# EAGLE board fmcboard_v1.4 (EAGLE 9.6.2)
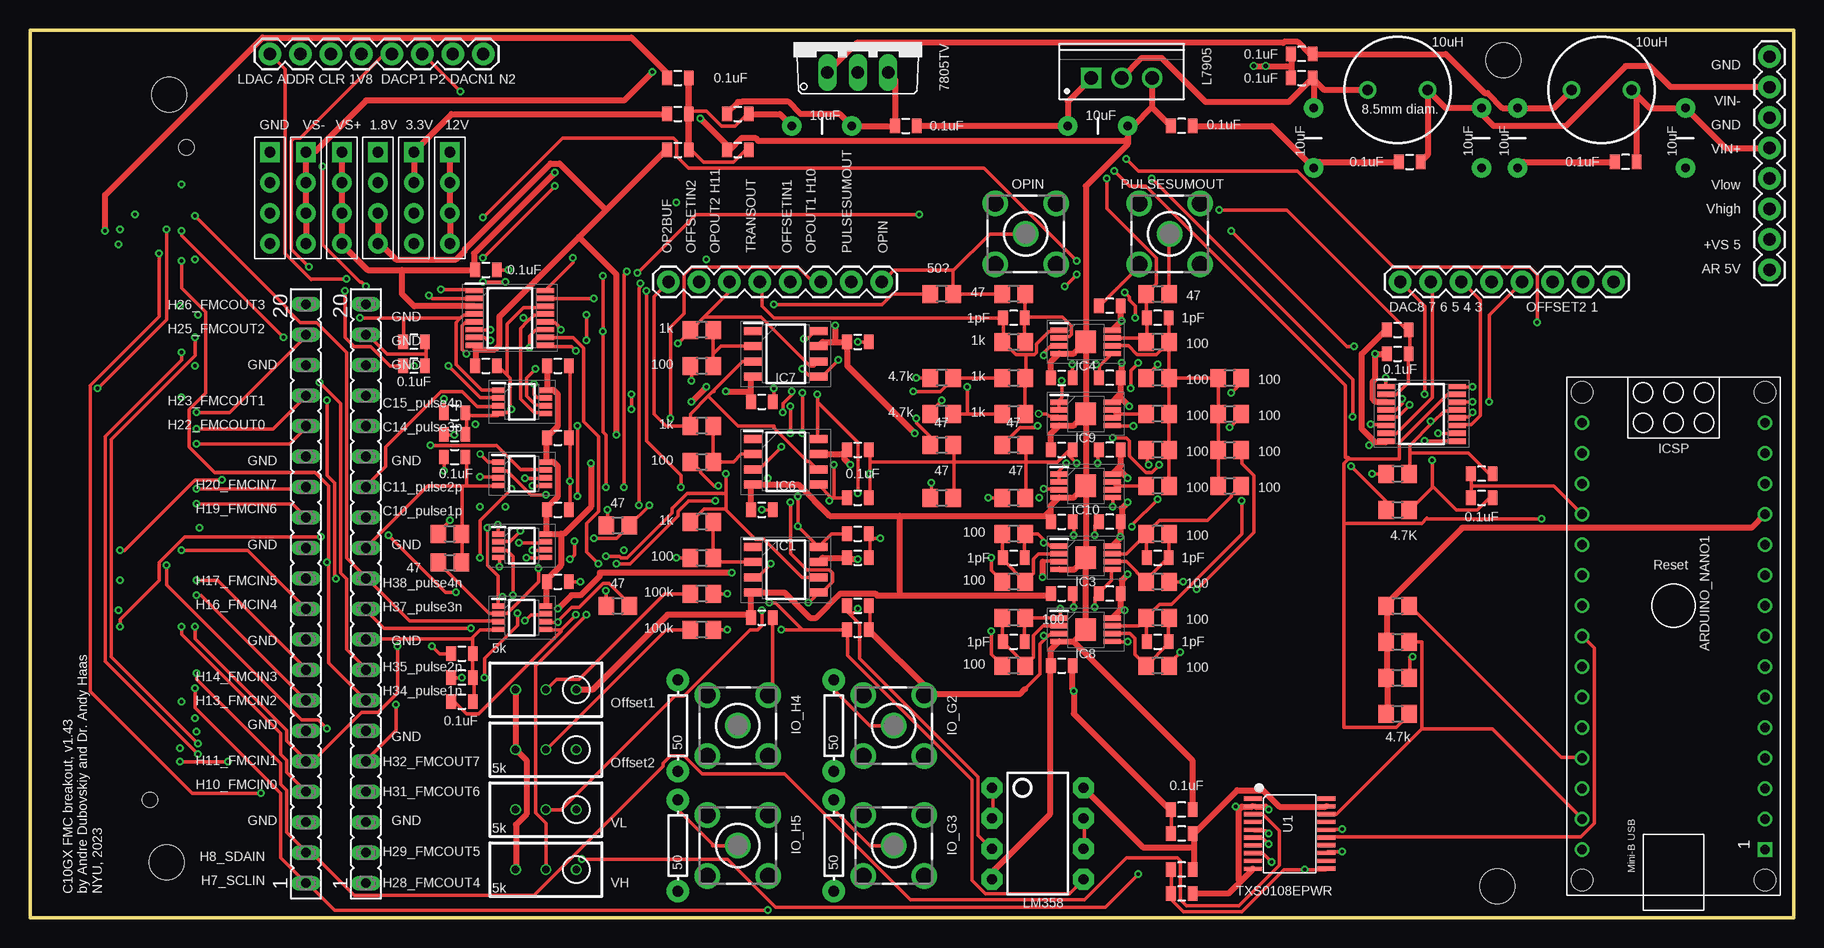
[diagram p4: board, top side]
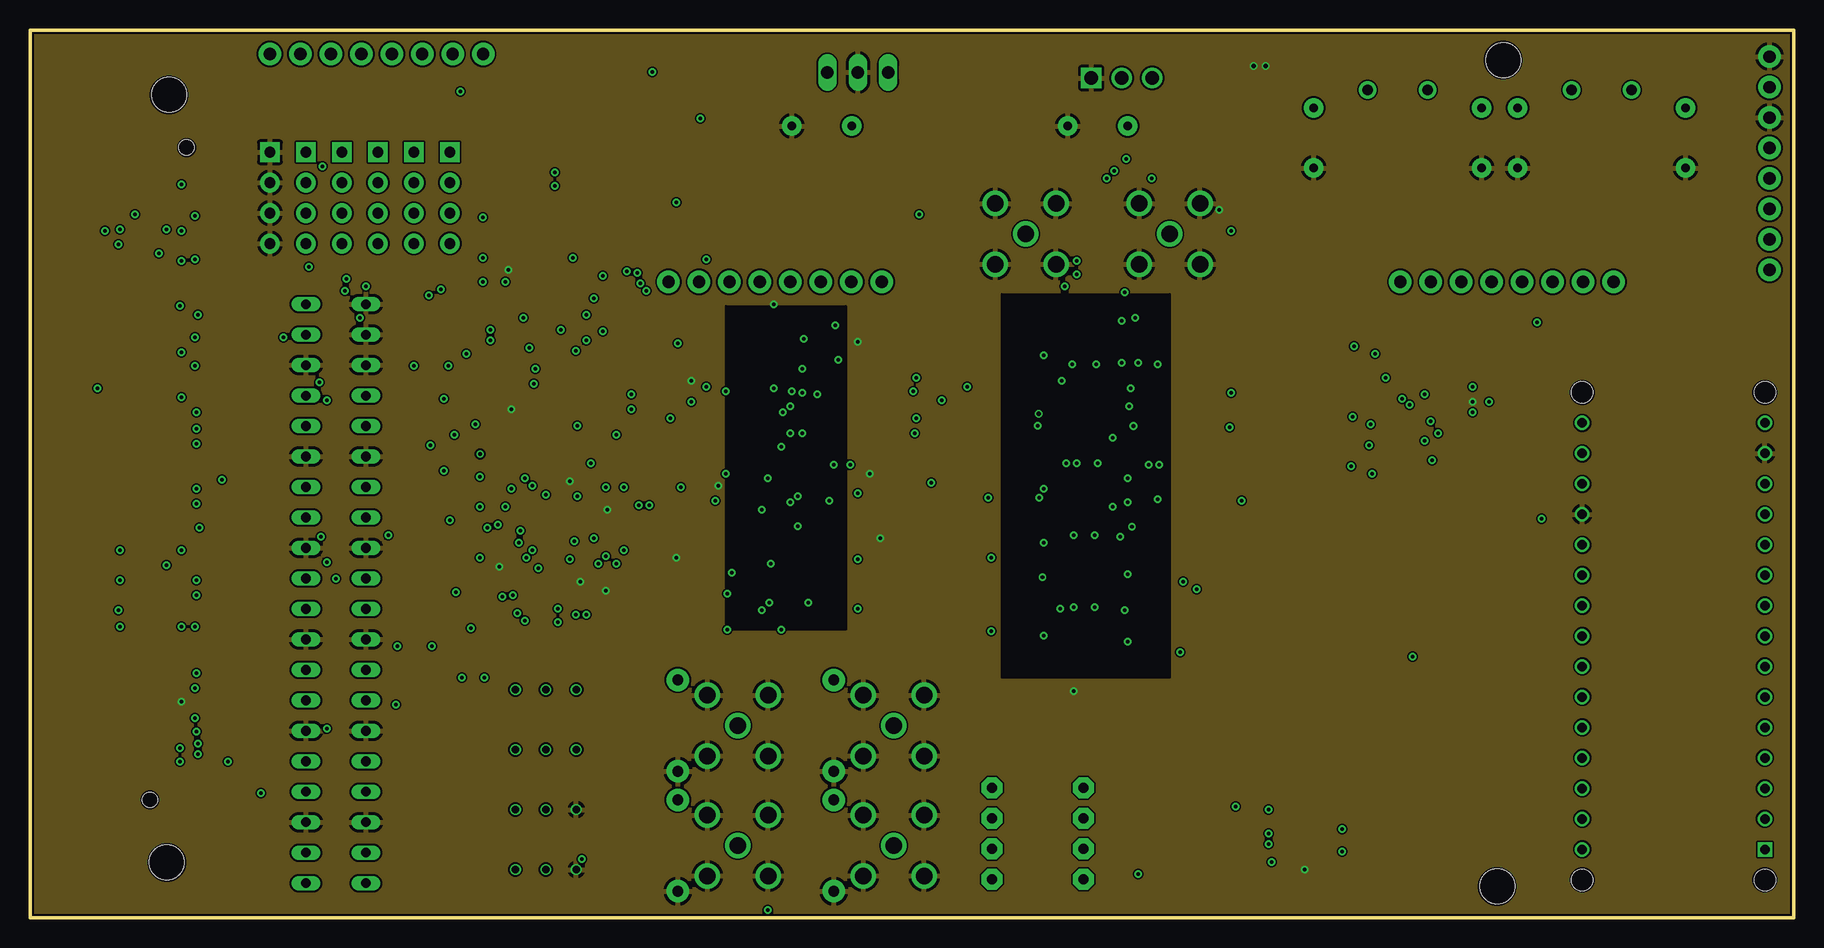
[diagram p5: board, inner layer topgnd]
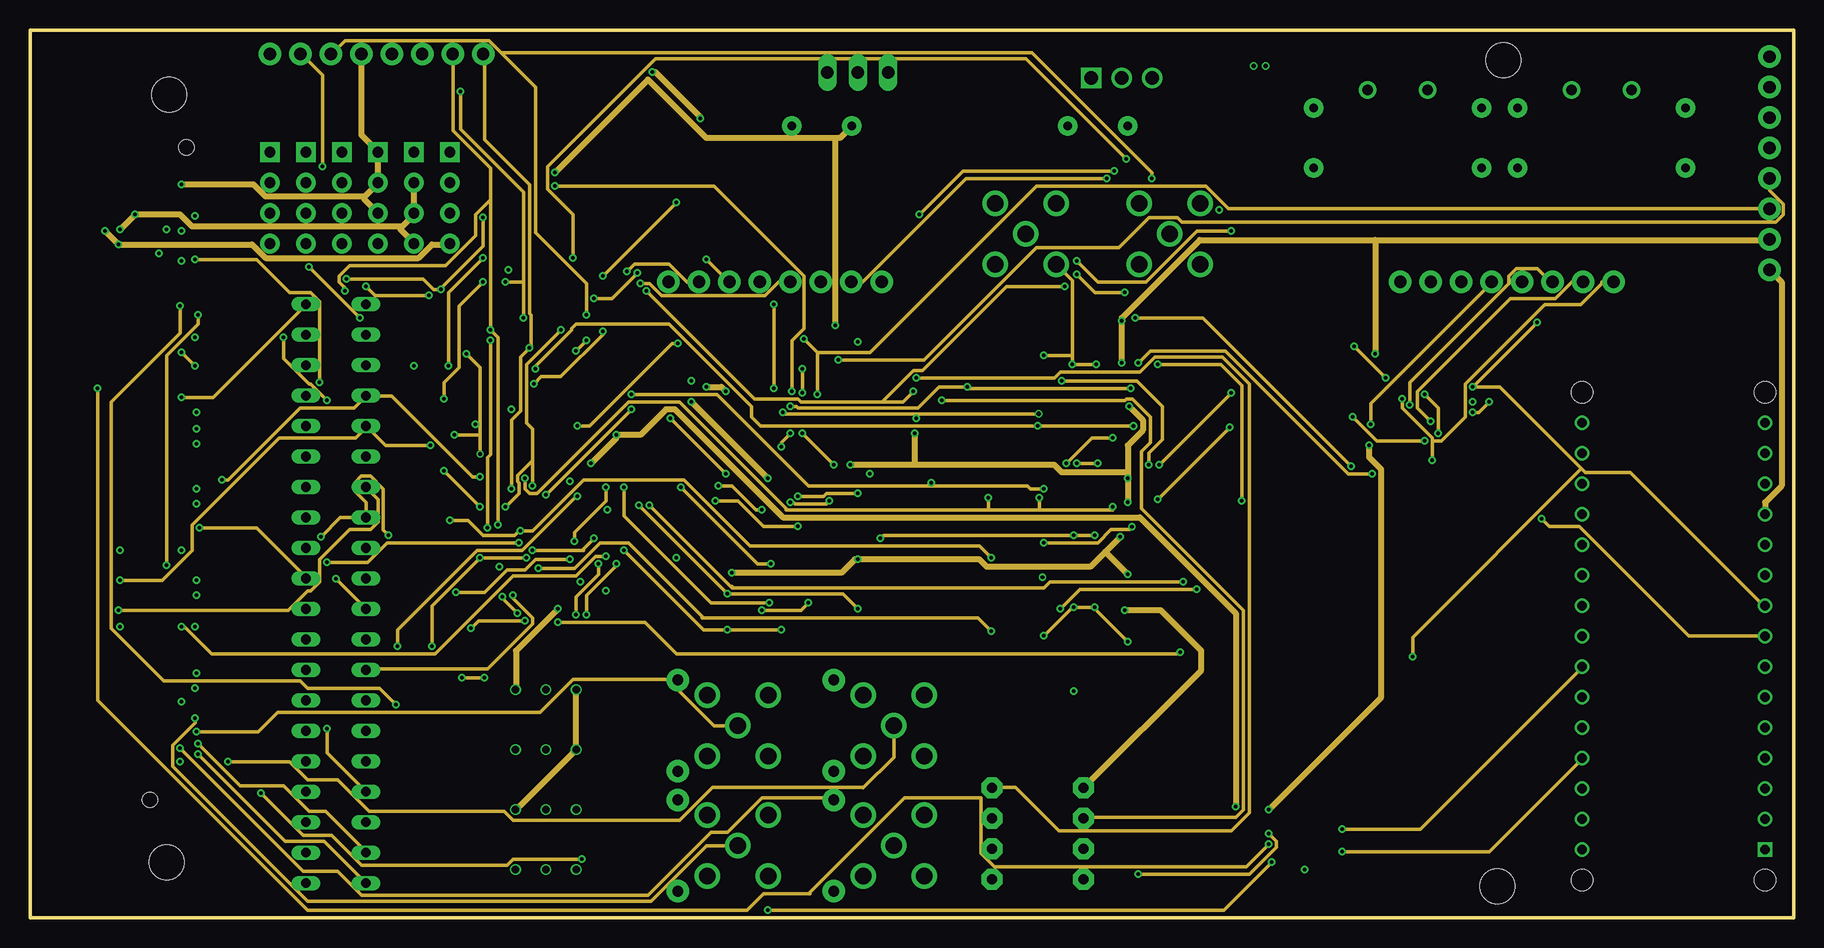
[diagram p6: board, inner layer route]
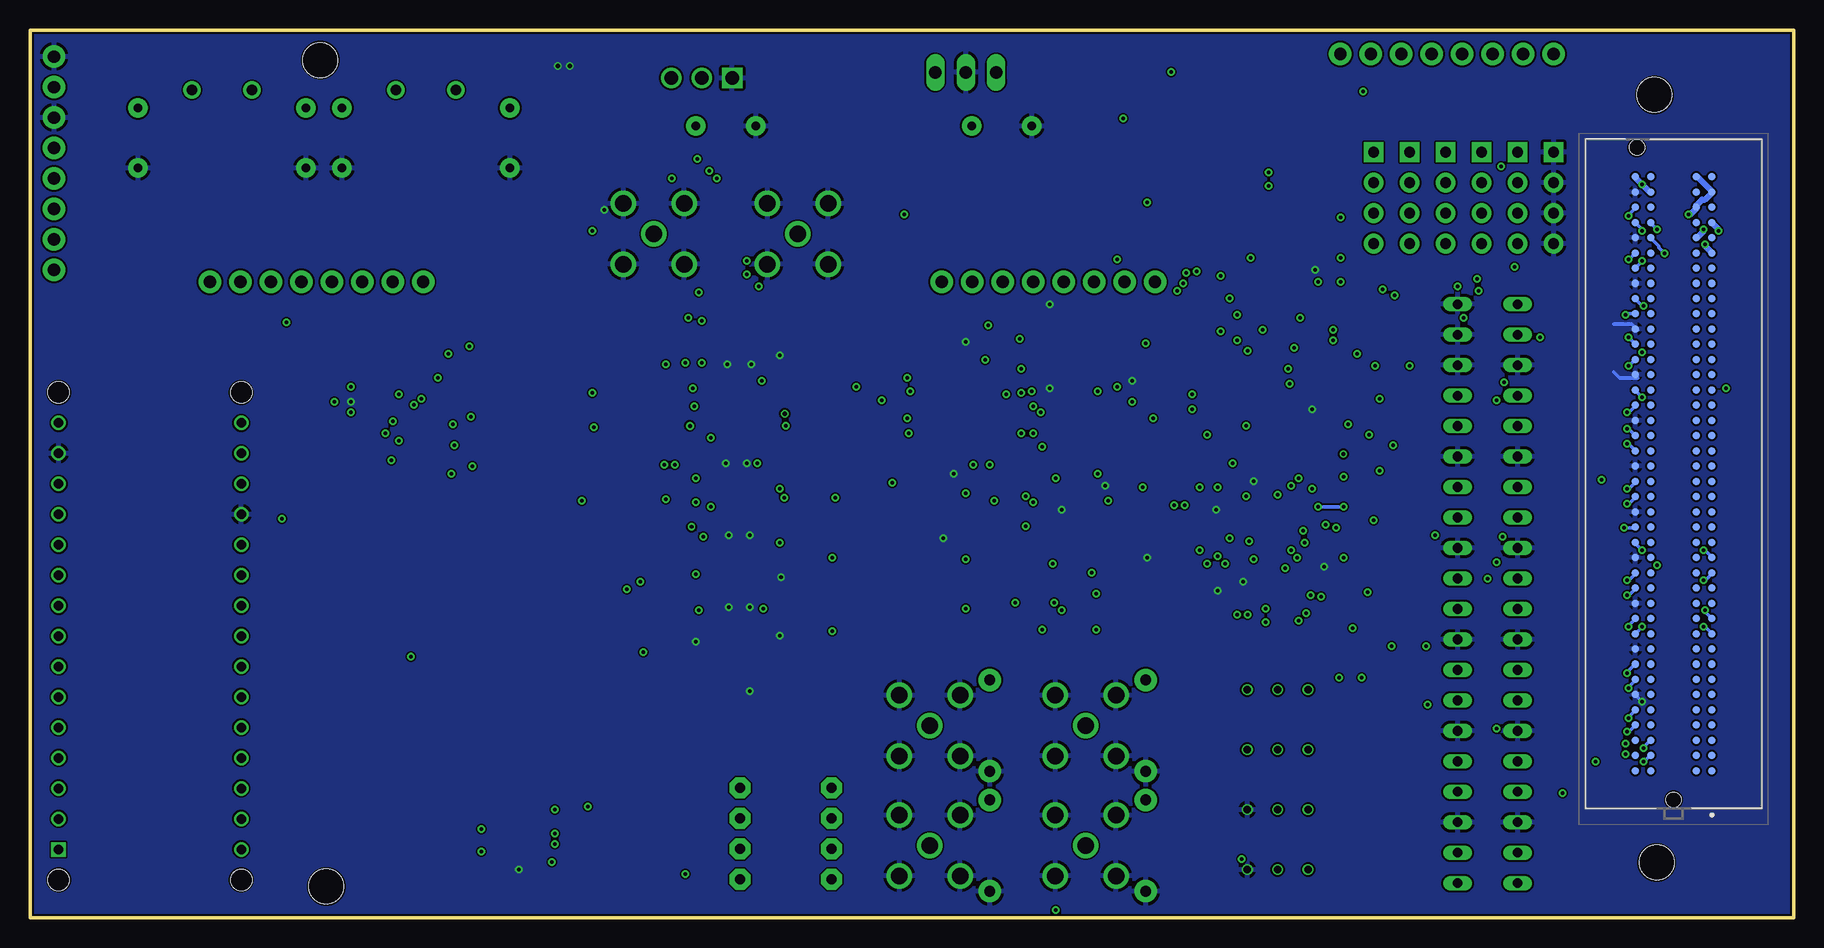
[diagram p7: board, bottom side, seen from below]

Size 147 x 74 mm. Coordinates in mm from the lower left corner, seen from the top.
Outline: 0,74 0,0 147,0 147,74 0,74
Copper layers (1*2*15*16): top 0.035mm / dielectric 0.2mm / topgnd 0.0175mm / dielectric 0.3mm / route 0.0175mm / dielectric 0.2mm / gnd 0.035mm
Design rules "Seeed_AllPCB_MacroFab_haas6mil": minimum track width 6mil, minimum drill 12mil, track to track 6mil, track to pad 6mil, pad to pad 6mil, via to via 6mil, smd to smd 0mil, copper to edge 6mil, drill to drill 6mil, minimum pad ring 6mil, minimum via ring 6mil, stop-mask expansion 6mil, vias tented up to drill 25mil, thermal gap 10mil
Net classes: 0 default: width 0.305 mm; 1 power: width 0.508 mm; 2 gnd: width 0.305 mm
Holes 2.9 mm at 11.4,4.6 122.8,71.5 11.6,68.6 122.3,2.6

## Footprints (pad centres in the part's own frame; a part is rotated, then mirrored left to right if it is on the bottom)
ARDUINO_NANO = drill 0.8 square: 1 -20.32,-7.62 | drill 0.8: 2 -17.78,-7.62; 3 -15.24,-7.62; 4 -12.7,-7.62; 5 -10.16,-7.62; 6 -7.62,-7.62; 7 -5.08,-7.62; 8 -2.54,-7.62; 9 0,-7.62; 10 2.54,-7.62; 11 5.08,-7.62; 12 7.62,-7.62; 13 10.16,-7.62; 14 12.7,-7.62; 15 15.24,-7.62; 16 15.24,7.62; 17 12.7,7.62; 18 10.16,7.62; 19 7.62,7.62; 20 5.08,7.62; 21 2.54,7.62; 22 0,7.62; 23 -2.54,7.62; 24 -5.08,7.62; 25 -7.62,7.62; 26 -10.16,7.62; 27 -12.7,7.62; 28 -15.24,7.62; 29 -17.78,7.62; 30 -20.32,7.62 | hole 1.778: -22.86,-7.62; -22.86,7.62; 17.78,7.62; 17.78,-7.62
CAP-PTH-5MM = drill 0.7 pad 1.651: 1 -2.5,0; 2 2.5,0
0805 = smd 0.8 x 1.2: 1 -0.9,0; 2 0.9,0
SOIC127P600X175-8N = smd 1.528 x 0.65: 1 -2.711,1.905; 2 -2.711,0.635; 3 -2.711,-0.635; 4 -2.711,-1.905; 5 2.711,-1.905; 6 2.711,-0.635; 7 2.711,0.635; 8 2.711,1.905
SOP65P640X120-16N = smd 1.475 x 0.45: 1 -2.938,2.275; 2 -2.938,1.625; 3 -2.938,0.975; 4 -2.938,0.325; 5 -2.938,-0.325; 6 -2.938,-0.975; 7 -2.938,-1.625; 8 -2.938,-2.275; 9 2.938,-2.275; 10 2.938,-1.625; 11 2.938,-0.975; 12 2.938,-0.325; 13 2.938,0.325; 14 2.938,0.975; 15 2.938,1.625; 16 2.938,2.275
SOP65P490X110-9N = smd 1.425 x 0.45: 1 -2.212,0.975; 2 -2.212,0.325; 3 -2.212,-0.325; 4 -2.212,-0.975; 5 2.212,-0.975; 6 2.212,-0.325; 7 2.212,0.325; 8 2.212,0.975 | smd 1.68 x 1.88: 9 0,0
DIP08 = drill 0.813 pad 1.727 octagon: 1 -3.81,-3.81; 2 -1.27,-3.81; 3 1.27,-3.81; 4 3.81,-3.81; 5 3.81,3.81; 6 1.27,3.81; 7 -1.27,3.81; 8 -3.81,3.81
TO220V = drill 1.016 long: 1 -2.54,-2.54; 2 0,-2.54; 3 2.54,-2.54
SOP65P400X130-8N = smd 1.1 x 0.45: 1 -1.95,0.975; 2 -1.95,0.325; 3 -1.95,-0.325; 4 -1.95,-0.975; 5 1.95,-0.975; 6 1.95,-0.325; 7 1.95,0.325; 8 1.95,0.975
BU-SMB-V = drill 1.4: 1 0,0; 2 -2.54,2.54; 3 2.54,2.54; 4 2.54,-2.54; 5 -2.54,-2.54
1X08 = drill 1.016 pad 1.88: 1 0,0; 2 2.54,0; 3 5.08,0; 4 7.62,0; 5 10.16,0; 6 12.7,0; 7 15.24,0; 8 17.78,0
ASP13460401 = smd 0.64 x 0.64: C1 24.765,3.175; C2 23.495,3.175; C3 22.225,3.175; C4 20.955,3.175; C5 19.685,3.175; C6 18.415,3.175; C7 17.145,3.175; C8 15.875,3.175; C9 14.605,3.175; C10 13.335,3.175; C11 12.065,3.175; C12 10.795,3.175; C13 9.525,3.175; C14 8.255,3.175; C15 6.985,3.175; C16 5.715,3.175; C17 4.445,3.175; C18 3.175,3.175; C19 1.905,3.175; C20 0.635,3.175; C21 -0.635,3.175; C22 -1.905,3.175; C23 -3.175,3.175; C24 -4.445,3.175; C25 -5.715,3.175; C26 -6.985,3.175; C27 -8.255,3.175; C28 -9.525,3.175; C29 -10.795,3.175; C30 -12.065,3.175; C31 -13.335,3.175; C32 -14.605,3.175; C33 -15.875,3.175; C34 -17.145,3.175; C35 -18.415,3.175; C36 -19.685,3.175; C37 -20.955,3.175; C38 -22.225,3.175; C39 -23.495,3.175; C40 -24.765,3.175; D1 24.765,1.905; D2 23.495,1.905; D3 22.225,1.905; D4 20.955,1.905; D5 19.685,1.905; D6 18.415,1.905; D7 17.145,1.905; D8 15.875,1.905; D9 14.605,1.905; D10 13.335,1.905; D11 12.065,1.905; D12 10.795,1.905; D13 9.525,1.905; D14 8.255,1.905; D15 6.985,1.905; D16 5.715,1.905; D17 4.445,1.905; D18 3.175,1.905; D19 1.905,1.905; D20 0.635,1.905; D21 -0.635,1.905; D22 -1.905,1.905; D23 -3.175,1.905; D24 -4.445,1.905; D25 -5.715,1.905; D26 -6.985,1.905; D27 -8.255,1.905; D28 -9.525,1.905; D29 -10.795,1.905; D30 -12.065,1.905; D31 -13.335,1.905; D32 -14.605,1.905; D33 -15.875,1.905; D34 -17.145,1.905; D35 -18.415,1.905; D36 -19.685,1.905; D37 -20.955,1.905; D38 -22.225,1.905; D39 -23.495,1.905; D40 -24.765,1.905; G1 24.765,-1.905; G2 23.495,-1.905; G3 22.225,-1.905; G4 20.955,-1.905; G5 19.685,-1.905; G6 18.415,-1.905; G7 17.145,-1.905; G8 15.875,-1.905; G9 14.605,-1.905; G10 13.335,-1.905; G11 12.065,-1.905; G12 10.795,-1.905; G13 9.525,-1.905; G14 8.255,-1.905; G15 6.985,-1.905; G16 5.715,-1.905; G17 4.445,-1.905; G18 3.175,-1.905; G19 1.905,-1.905; G20 0.635,-1.905; G21 -0.635,-1.905; G22 -1.905,-1.905; G23 -3.175,-1.905; G24 -4.445,-1.905; G25 -5.715,-1.905; G26 -6.985,-1.905; G27 -8.255,-1.905; G28 -9.525,-1.905; G29 -10.795,-1.905; G30 -12.065,-1.905; G31 -13.335,-1.905; G32 -14.605,-1.905; G33 -15.875,-1.905; G34 -17.145,-1.905; G35 -18.415,-1.905; G36 -19.685,-1.905; G37 -20.955,-1.905; G38 -22.225,-1.905; G39 -23.495,-1.905; G40 -24.765,-1.905; H1 24.765,-3.175; H2 23.495,-3.175; H3 22.225,-3.175; H4 20.955,-3.175; H5 19.685,-3.175; H6 18.415,-3.175; H7 17.145,-3.175; H8 15.875,-3.175; H9 14.605,-3.175; H10 13.335,-3.175; H11 12.065,-3.175; H12 10.795,-3.175; H13 9.525,-3.175; H14 8.255,-3.175; H15 6.985,-3.175; H16 5.715,-3.175; H17 4.445,-3.175; H18 3.175,-3.175; H19 1.905,-3.175; H20 0.635,-3.175; H21 -0.635,-3.175; H22 -1.905,-3.175; H23 -3.175,-3.175; H24 -4.445,-3.175; H25 -5.715,-3.175; H26 -6.985,-3.175; H27 -8.255,-3.175; H28 -9.525,-3.175; H29 -10.795,-3.175; H30 -12.065,-3.175; H31 -13.335,-3.175; H32 -14.605,-3.175; H33 -15.875,-3.175; H34 -17.145,-3.175; H35 -18.415,-3.175; H36 -19.685,-3.175; H37 -20.955,-3.175; H38 -22.225,-3.175; H39 -23.495,-3.175; H40 -24.765,-3.175 | hole 1.27: 27.189,0; -27.191,-3.05
H4-2.54 = drill 0.889 pad 1.651 square: 1 0,3.81 | drill 0.889 pad 1.651: 2 0,1.27; 3 0,-1.27; 4 0,-3.81
6000-XXXX-RC = drill 0.9 pad 1.422: 1 -2.5,0; 2 2.5,0
R0805 = smd 1.3 x 1.5: 1 -0.95,0; 2 0.95,0
AXIAL-0.3 = drill 0.9 pad 1.88: P$1 -3.81,0; P$2 3.81,0
RTRIM3296W = drill 0.61: 1 0,-2.54; 2 0,0; 3 0,2.54
FE20 = drill 0.813 long: 1 -24.13,0; 2 -21.59,0; 3 -19.05,0; 4 -16.51,0; 5 -13.97,0; 6 -11.43,0; 7 -8.89,0; 8 -6.35,0; 9 -3.81,0; 10 -1.27,0; 11 1.27,0; 12 3.81,0; 13 6.35,0; 14 8.89,0; 15 11.43,0; 16 13.97,0; 17 16.51,0; 18 19.05,0; 19 21.59,0; 20 24.13,0
TSSOP20-0.65-6.5X4.4MM = smd 0.35 x 1.5: 1 -2.925,-3.065; 2 -2.275,-3.065; 3 -1.625,-3.065; 4 -0.975,-3.065; 5 -0.325,-3.065; 6 0.325,-3.065; 7 0.975,-3.065; 8 1.625,-3.065; 9 2.275,-3.065; 10 2.925,-3.065; 11 2.91,3.065; 12 2.26,3.065; 13 1.61,3.065; 14 0.96,3.065; 15 0.325,3.065; 16 -0.325,3.065; 17 -0.975,3.065; 18 -1.625,3.065; 19 -2.275,3.065; 20 -2.925,3.065
STMICROELECTRONICS_L7905ACV_0 = drill 1.1 pad 1.7 square: 1 -2.54,0 | drill 1.1 pad 1.7: 2 0,0; 3 2.54,0

## Placement (x,y rotation side)
ARDUINO_NANO1  1  [ARDUINO_NANO]  137,26 90 top
C1  10uF  [CAP-PTH-5MM]  66,66 180 top
C2  10uF  [CAP-PTH-5MM]  89,66 0 top
C3  0.1uF  [0805]  59,67 0 top
C4  0.1uF  [0805]  69,24 0 top
C5  0.1uF  [0805]  54,64 0 top
C6  0.1uF  [0805]  96,7 180 top
C7  0.1uF  [0805]  69,32 0 top
C8  0.1uF  [0805]  69,35 0 top
C9  0.1uF  [0805]  96,4 180 top
C10  0.1uF  [0805]  59,64 0 top
C11  0.1uF  [0805]  69,26 0 top
C12  0.1uF  [0805]  54,70 0 top
C13  0.1uF  [0805]  54,67 0 top
C14  0.1uF  [0805]  96,2 180 top
C15  0.1uF  [0805]  96,9 180 top
C16  0.1uF  [0805]  90,51 180 top
C17  0.1uF  [0805]  86,45 0 top
C18  0.1uF  [0805]  90,45 180 top
C19  0.1uF  [0805]  86,39 0 top
C20  0.1uF  [0805]  90,39 180 top
C21  0.1uF  [0805]  86,33 0 top
C22  0.1uF  [0805]  90,33 180 top
C23  0.1uF  [0805]  86,27 0 top
C24  0.1uF  [0805]  90,27 180 top
C25  0.1uF  [0805]  86,21 0 top
C26  0.1uF  [0805]  69,48 0 top
C27  0.1uF  [0805]  61,43 0 top
C28  0.1uF  [0805]  69,39 0 top
C29  0.1uF  [0805]  61,34 0 top
C30  0.1uF  [0805]  69,30 0 top
C31  0.1uF  [0805]  61,25 0 top
C32  1pF  [0805]  94,50 180 top
C33  1pF  [0805]  82,50 180 top
C34  1pF  [0805]  82,30 0 top
C35  1pF  [0805]  82,23 0 top
C36  1pF  [0805]  94,30 0 top
C37  1pF  [0805]  94,23 0 top
C38  10uF  [CAP-PTH-5MM]  124,65 270 top
C39  10uF  [CAP-PTH-5MM]  138,65 270 top
C40  10uF  [CAP-PTH-5MM]  121,65 270 top
C41  10uF  [CAP-PTH-5MM]  107,65 270 top
C42  0.1uF  [0805]  133,63 180 top
C43  0.1uF  [0805]  106,72 180 top
C44  0.1uF  [0805]  115,63 0 top
C45  0.1uF  [0805]  106,70 0 top
C46  0.1uF  [0805]  96,66 180 top
C47  0.1uF  [0805]  73,66 0 top
C48  0.1uF  [0805]  38,54 0 top
C49  0.1uF  [0805]  38,46 0 top
C50  0.1uF  [0805]  44,46 0 top
C51  0.1uF  [0805]  44,40 0 top
C52  0.1uF  [0805]  44,34 0 top
C53  0.1uF  [0805]  44,28 0 top
C54  0.1uF  [0805]  114,47 0 top
C55  0.1uF  [0805]  114,49 0 top
C56  0.1uF  [0805]  35.4,40.3 180 top
C57  0.1uF  [0805]  32,46 180 top
C58  0.1uF  [0805]  32,48 180 top
C59  0.1uF  [0805]  36,20 180 top
C60  0.1uF  [0805]  36,18 0 top
C61  0.1uF  [0805]  36,22 0 top
C62  0.1uF  [0805]  35.4,38.4 0 top
C63  0.1uF  [0805]  35.4,42.1 0 top
C64  0.1uF  [0805]  121,35 0 top
C65  0.1uF  [0805]  121,37 180 top
IC1  OPA699ID  [SOIC127P600X175-8N]  63,29 0 top
IC2  DAC7578SPWR  [SOP65P640X120-16N]  40,50 0 top
IC3  LTC6229IMS8E#TRPBF  [SOP65P490X110-9N]  88,30 0 top
IC4  LTC6229IMS8E#TRPBF  [SOP65P490X110-9N]  88,48 0 top
IC5  LM358  [DIP08]  84,7 270 top
IC6  OPA699ID  [SOIC127P600X175-8N]  63,38 0 top
IC7  OPA699ID  [SOIC127P600X175-8N]  63,47 0 top
IC8  LTC6229IMS8E#TRPBF  [SOP65P490X110-9N]  88,24 0 top
IC9  LTC6229IMS8E#TRPBF  [SOP65P490X110-9N]  88,42 0 top
IC10  LTC6229IMS8E#TRPBF  [SOP65P490X110-9N]  88,36 0 top
IC11  7805TV  [TO220V]  69,73 0 top
IC12  SN74AUC2G66DCTR  [SOP65P400X130-8N]  41,43 0 top
IC13  SN74AUC2G66DCTR  [SOP65P400X130-8N]  41,37 0 top
IC14  SN74AUC2G66DCTR  [SOP65P400X130-8N]  41,31 0 top
IC15  SN74AUC2G66DCTR  [SOP65P400X130-8N]  41,25 0 top
IC16  DAC7578SPWR  [SOP65P640X120-16N]  116,42 0 top
IO_G2  BU-SMB-V  [BU-SMB-V]  72,16 270 top
IO_G3  BU-SMB-V  [BU-SMB-V]  72,6 270 top
IO_H4  BU-SMB-V  [BU-SMB-V]  59,16 270 top
IO_H5  BU-SMB-V  [BU-SMB-V]  59,6 270 top
J1  8pin  [1X08]  145,54 90 top
J2  ASP-134604-01  [ASP13460401]  10,37 270 bottom
J3  4p-2.54  [H4-2.54]  32,60 0 top
J4  4p-2.54  [H4-2.54]  20,60 0 top
J5  8pin  [1X08]  71,53 180 top
J6  4p-2.54  [H4-2.54]  26,60 0 top
J7  4p-2.54  [H4-2.54]  23,60 0 top
J8  4p-2.54  [H4-2.54]  35,60 0 top
J9  8pin  [1X08]  20,72 0 top
J10  8pin  [1X08]  132,53 180 top
J12  4p-2.54  [H4-2.54]  29,60 0 top
L1  10uH  [6000-XXXX-RC]  131,69 180 top
L2  10uH  [6000-XXXX-RC]  114,69 180 top
OPIN  BU-SMB-V  [BU-SMB-V]  83,57 90 top
PULSESUMOUT  BU-SMB-V  [BU-SMB-V]  95,57 0 top
R1  100  [R0805]  94,48 180 top
R2  47  [R0805]  82,52 180 top
R3  100k  [R0805]  56,27 180 top
R4  50  [AXIAL-0.3]  67,16 90 top
R5  50  [AXIAL-0.3]  67,6 90 top
R6  1k  [R0805]  56,49 180 top
R7  100  [R0805]  94,39 180 top
R8  100  [R0805]  100,45 0 top
R9  1k  [R0805]  56,33 180 top
R10  100  [R0805]  56,30 0 top
R11  1k  [R0805]  82,48 0 top
R12  100  [R0805]  100,42 0 top
R13  1k  [R0805]  82,45 0 top
R14  4.7k  [R0805]  76,45 180 top
R15  50  [AXIAL-0.3]  54,16 90 top
R16  50  [AXIAL-0.3]  54,6 90 top
R17  100k  [R0805]  56,24 180 top
R18  1k  [R0805]  56,41 180 top
R19  100  [R0805]  56,38 0 top
R20  1k  [R0805]  82,42 0 top
R21  100  [R0805]  82,32 180 top
R22  100  [R0805]  82,28 180 top
R23  100  [R0805]  94,32 180 top
R24  100  [R0805]  94,28 180 top
R25  4.7k  [R0805]  76,42 180 top
R26  100  [R0805]  56,46 0 top
R27  100  [R0805]  82,25 180 top
R28  100  [R0805]  82,21 180 top
R29  100  [R0805]  94,25 180 top
R30  100  [R0805]  94,21 180 top
R31  4.7k  [R0805]  114,37 0 top
R32  100  [R0805]  100,39 0 top
R33  100  [R0805]  94,42 180 top
R34  47  [R0805]  94,52 0 top
R35  4.7K  [R0805]  114,34 0 top
R36  100  [R0805]  94,36 180 top
R37  47  [R0805]  82,39.4 180 top
R38  100  [R0805]  100,36 0 top
R39  47  [R0805]  76,39.4 0 top
R40  100  [R0805]  94,45 180 top
R41  47  [R0805]  82,35 180 top
R42  50?  [R0805]  76,52 180 top
R43  47  [R0805]  76,35 0 top
R44  47  [R0805]  35,32 0 top
R45  47  [R0805]  35,29.6 0 top
R46  47  [R0805]  49,26 0 top
R47  47  [R0805]  49,32.7 0 top
R48  4.7k  [R0805]  114,17 0 top
R49  4.7k  [R0805]  114,20 0 top
R50  4.7k  [R0805]  114,23 0 top
R51  4.7k  [R0805]  114,26 0 top
R_O1  5k  [RTRIM3296W]  43,19 90 top
R_O2  5k  [RTRIM3296W]  43,14 90 top
R_VH  5k  [RTRIM3296W]  43,4 90 top
R_VL  5k  [RTRIM3296W]  43,9 90 top
SV1  20  [FE20]  23,27 90 top
SV2  20  [FE20]  28,27 90 top
U1  TXS0108EPWR  [TSSOP20-0.65-6.5X4.4MM]  105,7 270 top
U2  STMICROELECTRONICS_L7905ACVSTMICROELECTRONICS_L7905ACV_0_0  [STMICROELECTRONICS_L7905ACV_0]  91,70 0 top

## Tracks (layer width: path | path; a pad name or v marks a point on that pad's centre or on a via)
1V8  (via drill 0.3)
  top 0.508: C14.1 99.88,2 100.88,3 | 100.88,3 101.88,4 U1.10 | 100.75,9 101,9.25 101.88,9.25 U1.2 102.12,9.25 103,9.25 v103.25,9 | 100.75,9 100.75,3.12 100.88,3 | v100.5,9.25 100.75,9 | 37.12,47.38 37.12,47.62 IC2.8 | 37.12,47.38 37.12,46 C49.1 | 45.75,56.75 39.12,50.12 39.12,47.75 38.75,47.38 37.12,47.38 | 45.75,56.75 48,59 | 48,59 53,64 C5.1 | J12.3 J12.4 29.25,56.12 30.5,54.88 35.5,54.88 36.25,55.62 36.25,55.75 43.38,62.88 44.12,62.88 48,59 | 45.75,56.75 48.88,53.62 v48.88,40.25 | 112,39.75 112.12,39.62 113,39.62 IC16.8 | 112,39.75 111,40.75 111,47 113,49 C55.1 | v111.62,39.38 112,39.75 | 43.25,44 43.62,44 44,43.62 44,41 43,40 | 43.25,44 IC12.8 | 43,40 43,38 IC13.8 43.25,38 43.62,38 44,37.62 44,35.12 43.12,34.25 C52.1 43,34 43,32 IC14.8 43.25,32 44.25,32 | IC15.8 43,26 43,28 C53.1 43.12,28.25 44.25,29.38 44.25,32 | C51.1 43,40 | v46.75,37.88 46.75,34.25 44.5,32 44.25,32 | C50.1 43.1,44.15 43.25,44
  route 0.508: v100.5,9.25 100.5,25.38 92.5,33.38 62.75,33.38 53.75,42.38 53,42.38 50.88,40.25 v48.88,40.25 48.88,40 v46.75,37.88 | v12.62,61.12 18.62,61.12 19.62,60.12 27.88,60.12 | 27.88,60.12 29,61.25 J12.2 J12.1 28.88,64 27.62,65.25 J9.4 | J12.3 29,58.75 27.88,59.88 27.88,60.12 | v111.62,39.38 111.62,38.38 112.62,37.38 112.62,18.38 v103.25,9
  gnd 0.508: J2.G39 12,60.5 v12.62,61.12 13.25,61.75 J2.H40
3V3  (via drill 0.3)
  top 0.508: C13.1 35.12,67 32,63.88 J3.1 J3.2
  route 0.508: v7.5,57.38 v8.75,58.62 12.5,58.62 13.5,57.62 30.88,57.62 | 30.88,57.62 31,57.62 32,58.62 J3.3 J3.2 | J3.4 32,56.25 30.88,57.38 30.88,57.62
  gnd 0.508: J2.D36 8,56.75 7.5,57.25 v7.5,57.38 | J2.D40 8,61.75 6.88,60.62 J2.C39 6.88,60.38 7.38,59.88 7.62,59.88 8.12,59.38 J2.D38 8.12,59.12 8.62,58.62 v8.75,58.62
12V  (via drill 0.3)
  top 0.508: J8.4 J8.3 J8.2 J8.1 | v6.25,57.25 6.25,60.25 19.38,73.38 50.12,73.38 53,70.5 53,70 C12.1
  route 0.508: v6.25,57.25 v7.38,56.12 18.5,56.12 19.62,55 32.38,55 33.5,56.12 35,56.12 J8.4
  gnd 0.508: J2.C35 6.88,55.5 7.38,56 v7.38,56.12 | J2.C37 6.75,57.88 6.25,57.38 v6.25,57.25
AR_5V
  top 0.508: R48.1 113.12,17 113.12,20 R49.1 113.12,20.25 113.12,23 R50.1 113.12,23.25 113.12,26 R51.1 113.12,26.25 119.38,32.5 143.5,32.5 ARDUINO_NANO1.12
  route 0.508: J1.1 146,53 146,36 144.62,34.62 ARDUINO_NANO1.12
AR_G36  (via drill 0.3)
  top 0.305: v109.38,7.38 108.12,7.38 U1.16
  route 0.305: v109.38,7.38 115.88,7.38 129.38,20.88 ARDUINO_NANO1.24
AR_G37
  top 0.305: U1.15 108.12,6.75 129.25,6.75 130.38,7.88 130.38,22.5 129.5,23.38 ARDUINO_NANO1.23
AR_SCLIN  (via drill 0.3)
  top 0.305: v109.38,5.5 108.12,5.5 U1.13 | R51.2 115,26 127.62,13.38 129.38,13.38 ARDUINO_NANO1.27
  route 0.305: v109.38,5.5 121.62,5.5 129.38,13.25 ARDUINO_NANO1.27
AR_SCLIN2  (via drill 0.3)
  top 0.305: v120.25,44.25 119,44.25 IC16.16 | v45.25,55 45.25,54.62 43,52.38 IC2.16 | v91.38,63.25 92.38,62.25 105.62,62.25 113.62,54.25 125,54.25 125.62,53.62 v125.62,49.62 | v115.25,21.75 115,21.75 115,20 R49.2
  route 0.305: 129.31,37.44 129.62,37.12 133.38,37.12 144.5,26 ARDUINO_NANO1.9 | 129.31,37.44 122.5,44.25 v120.25,44.25 v125.62,49.62 | v45.25,55 45.25,58.62 43.12,60.75 43.12,62.62 52.12,71.62 83,71.62 v91.38,63.25 | v115.25,21.75 115.25,23.38 129.31,37.44
AR_SDAIN
  top 0.305: U1.18 108.88,8.62 116,15.75 | 116,15.75 116,23 R50.2 | 116,15.75 121.88,15.75 129.38,8.25 ARDUINO_NANO1.29
AR_SDAIN2  (via drill 0.3)
  top 0.305: IC16.15 118.12,43.62 114.12,39.62 114.12,38.25 109.88,38.25 | 109.88,38.25 109.5,37.88 109.5,32.88 | 109.5,32.88 109.5,15.88 113.88,15.88 115,17 R48.2 | v47,51.62 IC2.15 | v50.62,53.75 55.5,58.62 v74.12,58.62 | v90.38,62.25 91.62,61 93,61 109.62,44.38 109.62,38.38 109.88,38.38 109.88,38.25 | 109.5,32.88 116,32.88 116.44,33.31 116.5,33.25 v126,33.25
  route 0.305: v47,51.62 48.5,51.62 v50.62,53.75 | v74.12,58.62 77.75,62.25 v90.38,62.25 | v126,33.25 126.62,32.62 129.12,32.62 138.25,23.5 144.62,23.5 ARDUINO_NANO1.8
C10  (via drill 0.3)
  top 0.305: v7.5,24.25 7.5,24.88 10.75,28.12 10.75,29.62 12.88,31.75 v24.25,31.75 | v42,44.5 42,43.62 42.25,43.38 42.88,43.38 IC12.7 | v47.75,53.5 v47.75,48.88 47.75,40.5 48,40.25 v48,35.88 | v45.38,31.38 45.38,30.25 v45,29.88 | v35.5,27.12 34.62,27.12 v29.88,31.88
  route 0.305: v47.75,53.5 v53.88,59.62 | v47.75,48.88 47.75,48.62 44.23,45.1 42.6,45.1 v42,44.5 | v48,35.88 48,34.75 45.38,32.12 v45.38,31.38 | v45,29.88 42.12,29.88 41.25,29 39.75,29 37.88,27.12 v35.5,27.12 | v24.25,31.75 25.85,33.35 SV2.13 28,34.6 27.09,35.51 27.09,36.27 27.62,36.8 28.38,36.8 29.46,35.73 29.46,32.29 v29.88,31.88
  gnd 0.305: J2.C10 6.88,23.75 7.38,24.25 v7.5,24.25
C11  (via drill 0.3)
  top 0.305: IC12.3 39,42.62 37.25,42.62 36,43.88 34.25,43.88 29.62,39.25 29.62,37.62 28,36 SV2.14
  route 0.305: v7.38,25.62 21.5,25.62 23.12,27.25 23.38,27.25 24.12,28 24.12,29.88 26.62,32.38 28.38,32.38 29,33 29,34.88 28,35.88 SV2.14
  gnd 0.305: J2.C11 6.88,25 7.38,25.5 v7.38,25.62
C14  (via drill 0.3)
  top 0.305: v33.38,39.38 38.88,39.38 40.88,37.38 42.88,37.38 IC13.7
  route 0.305: v7.5,28.12 11,28.12 13.5,30.62 13.5,32.75 20.75,40 27.12,40 28,40.88 SV2.16 28.12,40.88 29.62,39.38 v33.38,39.38
  gnd 0.305: J2.C14 6.88,28.62 7.38,28.12 v7.5,28.12
C15  (via drill 0.3)
  top 0.305: v7.5,30.62 7.88,30.62 13.75,36.5 v16,36.5 | v37.5,36.75 39,36.75 IC13.3
  route 0.305: v16,36.5 16.5,36.5 22.5,42.5 27,42.5 SV2.17 28.12,43.5 30.12,43.5 36.88,36.75 v37.5,36.75
  gnd 0.305: J2.C15 6.88,30.12 7.38,30.62 v7.5,30.62
DAC3  (via drill 0.3)
  top 0.305: v115,42.75 114,41.75 113.12,41.75 IC16.5
  route 0.305: v115,42.75 115,44.62 123.25,52.88 123.25,53.5 123.88,54.12 125.62,54.12 126.75,53 J10.3
DAC4  (via drill 0.3)
  top 0.305: v120.25,42.12 119.88,41.75 119,41.75 IC16.12 | v121.62,43 121.62,50.25 J10.4
  route 0.305: v120.25,42.12 120.75,42.12 v121.62,43
DAC5  (via drill 0.3)
  top 0.305: v111.75,41.12 113,41.12 IC16.6
  route 0.305: v111.75,41.12 111.75,42.88 121.88,53 J10.5
DAC6
  top 0.305: IC16.11 119,41.12 120.12,41.12 120.88,41.88 120.88,51.5 119.38,53 J10.6
DAC7
  top 0.305: IC16.7 113.88,40.38 116.88,43.38 116.88,53 J10.7
DAC8  (via drill 0.3)
  top 0.305: v117.38,40.38 IC16.10 | v116.25,43.62 116.25,51 114.25,53 J10.8
  route 0.305: v117.38,40.38 117.38,42.5 v116.25,43.62
DACADDR  (via drill 0.3)
  top 0.305: v24.38,62.62 24.38,56.12 27.5,53 27.62,53 v28,52.62 | IC2.2 33.5,51.62 v33.25,51.88
  route 0.305: v24.38,62.62 24.38,70.25 22.62,72 J9.2 | v33.25,51.88 28.75,51.88 v28,52.62
DACCLR  (via drill 0.3)
  top 0.305: v45.5,47.25 45.12,47.62 43,47.62 IC2.9 | v46.38,50.25 v46.38,48.12 | v116.25,39.75 118.88,39.75 IC16.9 | v110.25,41.75 110.25,44.88 v93.5,61.62
  route 0.305: v46.38,48.12 v45.5,47.25 | v46.38,50.25 46.38,52.88 42.12,57.12 42.12,69.25 39.31,72.06 | 39.31,72.06 38.25,73.12 26.25,73.12 25.12,72 J9.3 | v116.25,39.75 112.25,39.75 v110.25,41.75 | v93.5,61.62 93.5,62.12 83.5,72.12 39.38,72.12 39.31,72.06
DACLDAC  (via drill 0.3)
  top 0.305: J9.1 21.25,70.75 21.25,55.38 23.44,53.19 23.5,53.25 v26.38,53.25 | v34.25,52.38 37,52.38 IC2.1 | v87.25,54.75 79.5,62.5 54.88,62.5 53.88,63.5 53.88,64.75 53.62,65 44.38,65 v37.75,58.38 | IC16.1 113,44.38 v113,45 | v110.38,47.62 109.75,47.62 v100.12,57.25
  route 0.305: v26.38,53.25 32.75,53.25 33.62,52.38 v34.25,52.38 34.25,52.5 37.75,56 v37.75,58.38 | v100.12,57.25 97.25,57.25 93,53 89,53 v87.25,54.75 | v110.38,47.62 v113,45
DACN1  (via drill 0.3)
  top 0.305: v39,32.75 39,32 IC14.1 | v38.38,49 37.12,49 IC2.6 | C57.2 v32,46 30,46 28.38,47.62 27,47.62 26.25,48.38 v26.25,52.25
  route 0.305: v39,32.75 39,48.38 v38.38,49 38.38,59.75 | J9.7 35.25,65.62 38.38,62.5 38.38,59.75 | v26.25,52.25 26.25,52.5 25.75,53 25.75,53.5 26.62,54.38 34.62,54.38 37.12,56.88 37.12,58.62 38.25,59.75 38.38,59.75
DACN2  (via drill 0.3)
  top 0.305: v41.38,30 42.88,30 IC14.5 | v37.5,30 37.5,33.12 v40.12,35.75 | v41.62,47.5 41.62,48.5 42.12,49 42.88,49 IC2.11 | C61.1 34.12,22 v33.5,22.62
  route 0.305: v41.38,30 v37.5,30 33.5,26 v33.5,22.62 | v40.12,35.75 40.12,41.5 40.88,42.25 40.88,46.75 v41.62,47.5 41.75,47.5 41.75,50.25 41.62,50.38 41.62,61.12 37.88,64.88 37.88,72 J9.8
DACN3  (via drill 0.3)
  top 0.305: 39,26.75 39,28.5 38.12,29.38 v38.12,32.5 | 39,26.75 39,26 IC15.1 | v38.38,48.12 38.12,48.12 37.88,48.38 IC2.7 | v40.62,25.38 40.62,24.38 37.88,21.62 v37.88,20 | 39,26.75 v39.38,26.75 | v36,20 C59.2
  route 0.305: v38.12,32.5 38.12,38.38 38.38,38.62 v38.38,48.12 | v40.62,25.38 39.38,26.62 v39.38,26.75 | v37.88,20 v36,20
DACN4  (via drill 0.3)
  top 0.305: 44.25,24 43,24 IC15.5 | v45.5,25.25 44.25,24 | IC2.10 45.25,48.38 46.12,47.5 46.12,41.38 47.38,40.12 47.38,33.88 46.38,32.88 46.38,30.5 v47.38,29.5 | C60.1 35.38,18 36.38,17 37.38,17 44.25,23.88 44.25,24
  route 0.305: v45.5,25.25 45.5,26.75 47.38,28.62 v47.38,29.5
DACOFFSET1  (via drill 0.3)
  top 0.305: 116.88,35.88 v116.88,38.12 | 115.5,34.5 115,34 R35.2 115.5,34.5 | 115.5,34.5 116.88,35.88 | v114.38,43.25 114.38,42.88 113.75,42.25 113.25,42.25 IC16.4 | C64.2 121.62,35 120.62,34 118.88,34 117,35.88 116.88,35.88
  route 0.305: J10.1 131,53 131,52.88 129.25,51.12 126.25,51.12 119.62,44.5 119.62,41.75 117.62,39.75 116.88,39.75 | v114.38,43.25 114.38,42.5 116.88,40 116.88,39.75 | v116.88,38.12 116.88,39.75
DACOFFSET2  (via drill 0.3)
  top 0.305: 116.94,41.31 115,39.38 115,38.75 | 116.94,41.31 117.88,42.25 118.88,42.25 IC16.13 | 115,38.75 115,37 R31.2 | v116.75,41.38 116.88,41.38 116.94,41.31 | C65.1 121.62,37 119.88,38.75 115,38.75
  route 0.305: J10.2 128.5,53 127.12,51.62 123.38,51.62 115.62,43.88 115.62,42.5 v116.75,41.38
DACP1  (via drill 0.3)
  top 0.305: 35.81,49.94 36.12,50.25 37,50.25 IC2.4 | 35.81,49.94 35.5,49.62 35.5,46.12 37.62,44 39,44 IC12.1 | J9.5 29.5,72 22.5,65 22,65 21.75,64.75 21.75,55.75 v23.25,54.25 | 31.12,50 35.75,50 35.81,49.94 | 31.12,50 v27.5,50 | 31.12,50 31.12,48 C58.2
  route 0.305: v27.5,50 v23.25,54.25
DACP2  (via drill 0.3)
  top 0.305: 41.44,49.69 42,50.25 42.88,50.25 IC2.13 | 41.44,49.69 40.88,49.12 40.88,43.25 42,42.12 42.88,42.12 IC12.5 | v35.88,68.88 32.75,72 J9.6 | 41.44,49.69 v41.12,50 | v39.62,53 v37.75,53 | v34.5,43.25 C63.1
  route 0.305: v35.88,68.88 35.88,65.75 41.12,60.5 41.12,53 | v41.12,50 41.12,53 | v37.75,53 35.75,51 35.75,45.88 34.5,44.62 v34.5,43.25 | 41.12,53 v39.62,53
DACP3  (via drill 0.3)
  top 0.305: v37.52,38.65 38.17,38 39,38 IC13.1 | v36.38,47 36,47.38 36,49.38 36.25,49.62 37,49.62 IC2.5 | v35.38,40.25 34.5,40.25 C56.2
  route 0.305: 37.52,41.12 37.52,45.85 v36.38,47 | 37.52,41.12 37.52,40.25 | 37.52,40.25 v37.52,38.65 | 37.52,41.12 v37.12,41.12 | 37.52,40.25 v35.38,40.25
DACP4  (via drill 0.3)
  top 0.305: v41.88,36 42.88,36 IC13.5 | v44.25,49 44,49.25 44,49.38 43.75,49.62 43,49.62 IC2.12 | v34.5,37.25 C62.1
  route 0.305: 41.88,38 41.88,40.75 41.38,41.25 41.38,46.12 v44.25,49 | 41.88,38 v41.88,36 | 41.88,38 41.75,38 40.62,36.88 40.62,36.38 40.75,36.25 40.75,35.38 v39.62,34.25 | v37.5,34.25 v34.5,37.25
  gnd 0.305: v39.62,34.25 v37.5,34.25
G2  (via drill 0.3)
  top 0.305: R4.P$2 67,19 70,16 IO_G2.1 | v16.5,13 v12.5,13
  route 0.305: IO_G2.1 72,13.38 69.44,10.81 69.38,10.88 56.88,10.88 54.12,8.12 40.25,8.12 39.5,8.88 28.25,8.88 25.62,11.5 23.12,11.5 21.62,13 v16.5,13
  gnd 0.305: v12.5,13 12,13.5 J2.G2
G3  (via drill 0.3)
  top 0.305: IO_G3.1 70,6 67,9 R5.P$2
  route 0.305: R5.P$2 67,9.88 66.88,10 61,10 58.12,7.12 56.75,7.12 51.5,1.88 27.62,1.88 25.62,3.88 22.75,3.88 v12.5,14.12
  gnd 0.305: J2.G3 12,14.75 12.5,14.25 v12.5,14.12
G36  (via drill 0.3)
  top 0.305: v92.38,3.62 89.62,0.88 62.12,0.88 58.12,4.88 v46,4.88 | v103.25,7 103,7.25 102,7.25 U1.5 | v10.75,55.38 10.75,50.12 5,44.38 5,18.88 13.5,10.38 v19.25,10.38
  route 0.305: v92.38,3.62 101.62,3.62 103.88,5.88 103.88,6.38 v103.25,7 | v19.25,10.38 22.75,6.88 25.12,6.88 27.62,4.38 39.75,4.38 40.25,4.88 v46,4.88
  gnd 0.305: J2.G36 11.88,56.62 11.25,56 11.25,55.88 v10.75,55.38
G37  (via drill 0.3)
  top 0.305: v103.25,6.12 102.75,6.62 102,6.62 U1.6 | v11.38,57.38 11.38,49.88 v5.62,44.12
  route 0.305: v103.25,6.12 101.38,4.25 80.38,4.25 79.25,5.38 79.25,10 72.88,10 65,2.12 65,2 61.12,2 59.75,0.62 23.12,0.62 5.62,18.12 v5.62,44.12
  gnd 0.305: v11.38,57.38 11.88,57.88 J2.G37
GND  (via drill 0.3, 0.35)
  top 0.305: 70,38 70,39 C28.2 | 70,38 v70,37 70,35 C8.2 | C19.2 86.62,39 86.38,38.75 | 86.38,38.75 85.62,38 83,38 | 70,38 77,38 | 77,38 83,38 | v89,37.88 89,39 C20.2 | 86.38,38.75 v87.25,37.88 | 95,9 C15.2 95.12,8.88 95.12,7 C6.2 | C9.2 95.12,4 95.12,2 C14.2 95.12,1.88 95.12,1.5 96.12,0.5 101,0.5 104.5,4 v106.25,4 108,4 U1.11 | C43.2 105.12,72 105.12,71 105.12,70.12 C45.1 | C13.2 55,67 55,64 C5.2 55.12,64 56.12,63 58.62,63 59.62,64 C10.2 | C12.2 55,70 55,67.12 C13.2 | v87,25.88 87,27 C23.2 | v88.75,25.88 88.75,26.75 89,27 C24.2 89.12,27.12 90.12,28.12 90.12,29 IC3.5 | v91.5,23 90.25,23 IC8.5 | 89.12,46 89.12,45 C18.2 | 89.12,46 90.12,47 IC4.5 | v87,31.88 87,33 C21.2 | v88.75,31.88 88.75,32.75 89,33 C22.2 | C30.2 70,30 70,32 C7.2 70.12,31.62 v70.88,31.62 | C11.2 70,26 70,24 C4.2 70,23.88 75.12,18.75 IO_G2.2 | IO_H4.2 61.88,18.88 61.88,25 C31.2 | v61,34 C29.2 | v62,44.12 62,43 C27.2 | v69,48 C26.2 | v86.88,46.12 86.88,45 C17.2 | C16.2 89.12,51 92.5,54.38 PULSESUMOUT.5 | 114,63 C44.1 | 84.69,23.31 84.2,22.82 84.2,20.32 82.94,19.06 | 84.69,23.31 85,23.62 85.75,23.62 IC8.3 | v84.5,46.88 84.5,47.12 85,47.62 85.75,47.62 IC4.3 | v53.88,30 R10.1 | v57.38,36 57,36 55.88,37.12 55.88,37.25 55.12,38 R19.1 | v55.12,44.75 55.12,46 R26.1 | R42.2 71.88,52 71,51.12 v62,51.12 | v88.88,46.12 89,46 89.12,46 | 84.69,23.31 v84.5,23.5 | C13.2 55.12,67.25 56.38,67.25 57.62,66 58.75,66 59.75,67 C3.2 | IC3.3 85.75,29.75 84.62,29.75 84.4,29.68 | 40,42.38 39.75,42.12 39.12,42.12 IC12.4 39,41.88 36.5,41.88 C63.2 36.38,42 36.38,40.38 C56.1 | 40,42.38 40,45 39.69,45.31 | 39.69,45.31 39,46 C49.2 | IC2.14 42.88,50.88 41.12,50.88 39.75,49.5 39.75,45.38 39.69,45.31
  top 0.305: C52.2 45,34 v45,36.38 45,40 C51.2 45,40.12 45,46 C50.2 | 36.75,23.25 37.5,24 39,24 IC15.4 | 36.75,23.25 28,23.25 SV2.9 | v39.12,29.25 39.12,30 IC14.4 | 36,36 33.12,36 28,30.88 SV2.12 | 36,36 36.38,36 | 36.38,36 39,36 IC13.4 | v45.88,28 C53.2 | v39.88,54 C48.2 | v40.12,42.38 40,42.38 | v120.25,43 119,43 IC16.14 | IC16.2 113.88,43.62 114.88,44.62 114.88,46.88 C54.2 115,47 115,49 C55.2 114.75,49 104.75,59 v99.12,59 | R45.2 36,29.62 36,32 R44.2 36,32.12 36,36 | 120.12,36 120.12,37 C65.2 | 120.12,36 120.12,35 C64.1 | C60.2 37,18 37,20 C59.1 36.88,20.12 36.88,21.88 C61.2 36.88,22 36.88,23.25 36.75,23.25 | 33,47 33,48 C58.1 | 33,47 33,46 C57.1 | 36.38,36 36.38,38.38 C62.2 | v48,27.25 48,26 R46.1 | v48.12,34 48.12,32.75 R47.1 | 77,38 77,35 R43.2 | 83,38 83,35 R41.1 | 77,38 77,39.38 R39.2 | 83,38 83,39.38 R37.1 | 33,47 29.75,47 28.25,48.5 28,48.5 SV2.19 | 120.12,36 127,36 ARDUINO_NANO1.19
  top 0.508: 84.4,29.68 v84.4,28.38 | U2.1 86.5,68.04 C2.1 C47.2 | C3.2 62.5,67 C1.2 | C5.2 C12.2 | C46.1 103.5,66 C41.2 107.5,63 114,63 | v102,71 v103,71 105.12,71 | C43.2 105.12,71.97 105.12,70.12 | C38.2 124.5,63 C42.2 | 95,9 87,17 v87,18.88 86.9,18.98 C25.2 | C4.2 75,18.9 75,18.62 | 75,18.62 74.62,18.62 IO_G2.2 | 75,18.62 82.5,18.62 82.94,19.06
  topgnd 0.305: v62,51.12 62,51.28 | v87,18.88 87,18.72
  route 0.305: v87.25,37.88 v89,37.88 | v91.5,23 88.75,25.75 v88.75,25.88 v87,25.88 86.88,25.88 v84.5,23.5 | v88.75,31.88 v87,31.88 71.12,31.88 v70.88,31.62 | v61,34 60.5,34 58.5,36 v57.38,36 | v62,51.12 v62,44.12 | 86.88,46.88 86.88,53.12 OPIN.5 | 86.88,46.88 v86.88,46.12 v88.88,46.12 | 86.88,46.88 v84.5,46.88
  gnd 0.305: 15,45.5 14.5,45 13,45 J2.H27 | 15,49.5 13.5,49.5 13,49 J2.H30 | v12.62,18 13.12,18.5 J2.H6
  pour gnd: 148,75 148,-2 -1,-2 -1,75
  pour topgnd: 149,77 149,-3 -4,-3 -4,77
  cutout topgnd: 81,52 95,52 95,20 81,20
  cutout topgnd: 58,51 68,51 68,24 58,24
H4  (via drill 0.3)
  route 0.305: 53.25,19.88 54,19.88 R15.P$2 | IO_H4.1 57,16 53.25,19.75 53.25,19.88 | v13.88,15.5 19,15.5 20.62,17.12 42.5,17.12 45.25,19.88 53.25,19.88
  gnd 0.305: J2.H4 13.25,16 13.75,15.5 v13.88,15.5
H5  (via drill 0.3)
  top 0.305: IO_H5.1 56.88,6 56.88,6.12 54,9 R16.P$2
  route 0.305: v13.75,16.62 13.75,16.25 11.88,14.38 11.88,12.62 23.12,1.38 51.75,1.38 56.38,6 IO_H5.1
  gnd 0.305: J2.H5 13.25,17.25 13.75,16.75 v13.75,16.62
H13  (via drill 0.3)
  top 0.305: v13.88,26.88 14.25,26.88 23,18.12 SV1.7
  gnd 0.305: J2.H13 13.25,27.38 13.75,26.88 v13.88,26.88
H14  (via drill 0.3)
  top 0.305: v13.88,28.12 15.62,28.12 23,20.75 SV1.8
  gnd 0.305: J2.H14 13.25,28.62 13.75,28.12 v13.88,28.12
H16  (via drill 0.3)
  top 0.305: v12.62,30.62 18.12,30.62 23,25.75 SV1.10
  gnd 0.305: v12.62,30.62 13.12,31.12 J2.H16
H17  (via drill 0.3)
  route 0.305: v14.12,32.5 18.88,32.5 23,28.38 SV1.11
  gnd 0.305: v14.12,32.5 13.25,32.5 J2.H17
H19  (via drill 0.3)
  top 0.305: v13.88,34.5 21.88,34.5 23,33.38 SV1.13
  gnd 0.305: J2.H19 13.25,35 13.75,34.5 v13.88,34.5
H20  (via drill 0.3)
  top 0.305: v13.88,35.75 22.88,35.75 23,35.88 SV1.14
  gnd 0.305: J2.H20 13.25,36.25 13.75,35.75 v13.88,35.75
H22  (via drill 0.3)
  top 0.305: v13.88,39.5 21.62,39.5 23,40.88 SV1.16
  gnd 0.305: J2.H22 13.25,39 13.75,39.5 v13.88,39.5
H23  (via drill 0.3)
  top 0.305: v13.88,40.75 20.25,40.75 SV1.17
  gnd 0.305: J2.H23 13.75,40.75 v13.88,40.75
H25  (via drill 0.3)
  top 0.305: v13.88,42.12 16.62,42.12 23,48.5 SV1.19
  gnd 0.305: J2.H25 13.25,42.62 13.75,42.12 v13.88,42.12
H26  (via drill 0.3)
  route 0.305: v12.62,43.38 15.25,43.38 SV1.20
  gnd 0.305: v12.62,43.38 13.12,43.88 J2.H26
H27  (via drill 0.3)
  top 0.305: v12.62,47.12 12.62,46.5 6.25,40.12 6.25,21.38 v14,13.62
  route 0.305: v12.62,47.12 v13.75,46 | v14,13.62 21.25,6.38 24.5,6.38 SV2.1
  gnd 0.305: v13.75,46 13.25,46.5 J2.H28
H28  (via drill 0.3)
  top 0.305: v13.75,48.38 13.75,46.88 6.75,39.88 6.75,21.75 v14,14.5
  route 0.305: v14,14.5 17.5,11 21.12,11 23.25,8.88 24.62,8.88 28,5.5 SV2.2
  gnd 0.305: v13.75,48.38 13.25,47.88 J2.H29
H31  (via drill 0.3)
  top 0.305: v11.38,29.38 11.38,27.75 22.62,16.5 24,16.5 v24.75,15.75
  route 0.305: v14,50.25 14,49.5 11.38,46.88 v11.38,29.38 | v24.75,15.75 24.75,13.75 SV2.4
  gnd 0.305: J2.H31 13.25,50.38 14,50.38 v14,50.25
H32  (via drill 0.3)
  top 0.305: v30.5,17.75 30.5,15.62 28,13.12 SV2.5
  route 0.305: v12.5,51 12.5,48.75 6.75,43 6.75,24.12 11.12,19.75 22.5,19.75 23.12,19.12 29.12,19.12 v30.5,17.75
  gnd 0.305: J2.H32 13.12,51.5 12.62,51 v12.5,51
H34  (via drill 0.3)
  top 0.305: v12.62,54.75 12.62,52.5 14.62,50.5 14.62,43.75 13.25,42.38 13.25,39.25 15.38,37.12 23.75,37.12 24.88,36 24.88,29.62 | 24.88,29.62 24.88,21.25 28,18.12 SV2.7 | v40.75,31.25 42.88,31.25 IC14.7 | v24.75,29.62 24.88,29.62
  route 0.305: v40.75,31.25 29.75,31.25 28.12,29.62 v24.75,29.62
  gnd 0.305: v12.62,54.75 13.12,54.25 J2.H34
H35  (via drill 0.3)
  top 0.305: v24.12,44.62 25.88,42.88 25.88,28.75 26.38,28.25 26.38,22.38 28,20.75 SV2.8 | v40.25,26.88 40.25,30.12 39.75,30.62 39.12,30.62 IC14.3
  route 0.305: v13.75,54.88 18.88,54.88 21.62,52.12 23.38,52.12 24.12,51.38 v24.12,44.62 | v40.25,26.88 40.25,26.62 41.88,25 41.88,24.5 38.12,20.75 28,20.75 SV2.8
  gnd 0.305: v13.75,54.88 13.25,55.38 J2.H35
H37  (via drill 0.3)
  top 0.305: v12.62,57.25 12.62,56.88 v21.12,48.38 | v24.75,43.12 24.75,36.88 25.38,36.25 25.38,28.38 v25.5,28.25 | v41.25,24.75 41.75,25.25 42.88,25.25 IC15.7 | v36.75,24.12 29.5,24.12 28,25.62 SV2.10
  route 0.305: v21.12,48.38 21.12,46.62 23.25,44.5 23.38,44.5 v24.75,43.12 | v25.5,28.25 28,25.75 SV2.10 | v41.25,24.75 37.38,24.75 v36.75,24.12
  gnd 0.305: J2.H37 13.12,57.88 12.62,57.38 v12.62,57.25
H38  (via drill 0.3)
  top 0.305: v13.75,58.5 21.38,50.88 21.38,50.75 22.5,49.62 23.88,49.62 26.38,47.12 26.38,30 28,28.38 SV2.11 28.12,28.25 31.62,24.75 39,24.75 IC15.3
  gnd 0.305: J2.H38 13.25,59.12 13.75,58.62 v13.75,58.5
IO1
  top 0.305: OPIN.1 80,57 76.95,53.95 | 76.95,53.95 76.95,54 72,54 J5.1 | 76.95,53.95 R42.1 R2.2
N$1  (via drill 0.3)
  top 0.305: R13.1 R14.1 76.88,44.88 75.88,43.88 v73.62,43.88 | v61.75,29.5 60.62,28.38 60.38,28.38 IC1.3 | v54.25,35.88 54.25,36.88 51.38,39.75 v51.38,52.25 | v110.12,37.62 113,34.75 113,34 R35.1 | v92.12,50 92.12,51 91.62,51.5 91.62,51.75 v91.25,52.12 | v86.25,52.62 v87.25,53.62
  route 0.305: v61.75,29.5 60.62,29.5 v54.25,35.88 | v51.38,52.25 60.38,43.25 64,43.25 64.25,43 71.12,43 | 71.12,43 72.75,43 v73.62,43.88 | v110.12,37.62 97.75,50 v92.12,50 | v91.25,52.12 88.75,52.12 v87.25,53.62 | v86.25,52.62 81.38,52.62 74.38,45.62 73.62,45.62 71.12,43.12 71.12,43
N$2
  top 0.305: R17.2 53,24 R_O2.2
N$3
  top 0.305: R9.1 R10.2 57.31,29.64 IC1.2
N$4
  top 0.305: R23.1 94.95,30.05 C36.2 94.85,30 93.05,28.2 R24.2 91.38,29.68 IC3.6
N$8
  top 0.305: R3.2 52.88,27 45.75,19.88 43.88,19.88 R_O1.2
N$9
  top 0.305: R18.1 R19.2 58.65,38 59.29,38.63 IC6.2
N$10  (via drill 0.3)
  top 0.305: R20.1 78.12,42 | 78.12,42 R25.1 | v62.62,39.25 60.75,37.38 60.38,37.38 IC6.3 | v63.38,42.62 v63.38,40.38 | 78.12,42 v78.12,44.25 | v111.88,37 R31.1 | v92.38,46.25 91.75,45.62 v91.75,44.12
  route 0.305: v62.62,39.25 62.62,39.62 v63.38,40.38 | v63.38,42.62 63.88,42.62 64,42.5 74,42.5 75.75,44.25 v78.12,44.25 78.12,44.12 v91.75,44.12 | v111.88,37 109.88,37 99.62,47.25 93.38,47.25 v92.38,46.25
N$11
  top 0.305: R6.1 56.95,47 | 56.95,47 R26.2 | 56.95,47 57.59,47.63 IC7.2
N$12
  top 0.305: R27.2 81.05,23.05 C35.1 82.95,21.15 R28.1 83.64,21.69 83.64,23.5 84.44,24.3 85.77,24.3 IC8.2
N$13
  top 0.305: R21.2 81.05,30.05 C34.1 81.1,29.85 R22.1 83.64,28.69 83.64,29.91 84.06,30.32 IC3.2
N$14
  top 0.305: IC8.6 91.69,23.68 92.11,23.25 92.11,21.94 R30.2 94.9,22.85 C37.2 94.9,24.95 R29.1
N$18
  top 0.305: R34.2 94.95,56.95 PULSESUMOUT.1
OFFSETIN1  (via drill 0.3)
  top 0.305: 68.44,25.19 69.12,24.5 69.12,21.62 79,11.75 79,6.88 80.12,5.75 IC5.3 | 68.44,25.19 68.12,25.5 68.12,26 C11.1 | v58.12,27 R3.1 | 68.44,25.19 v69,25.75 | v50.88,52.88 50.88,52.62 50.75,52.5 v50.75,34.38
  route 0.305: v69,25.75 67.75,27 v58.12,27 v50.75,34.38 | J5.4 62.38,53 61.25,51.88 52.62,51.88 51.62,52.88 v50.88,52.88
OFFSETIN2  (via drill 0.3)
  top 0.305: IC5.5 87.75,3.12 86.62,2 79.62,2 78.5,3.12 78.5,11.5 68.12,21.88 68.12,24 C4.1 64.25,24 | v58.12,24 R17.1 | 64.25,24 v62.62,24 | v49.75,53.88 49.5,53.62 v49.5,35.88 | v61.62,26.25 62.12,26.25 64.25,24.12 64.25,24
  route 0.305: v62.62,24 v58.12,24 56.12,24 v49.5,30.62 | J5.7 54.75,53 53.25,54.5 50.38,54.5 v49.75,53.88 | v49.5,35.88 49.5,33.5 56.75,26.25 v61.62,26.25
OFFSETOUT1  (via drill 0.3)
  top 0.305: v73.88,45 R14.2 | IC5.2 80.25,8.38 80.25,10.75 IC5.1
  route 0.305: v73.88,45 85.38,45 85.88,45.5 92.5,45.5 93.75,46.75 99.38,46.75 101.62,44.5 101.62,8.75 100.12,7.25 85.75,7.25 82.12,10.88 80.25,10.88 IC5.1
OFFSETOUT2  (via drill 0.3)
  top 0.305: v76,43.12 75.12,42.25 75.12,42 R25.2 | IC5.6 87.88,5.75 87.88,8.25 IC5.7
  route 0.305: v76,43.12 91.25,43.12 91.38,43.25 91.88,43.25 93.38,41.75 93.38,39.62 92.62,38.88 92.62,34.12 101.12,25.62 101.12,9 100.5,8.38 87.88,8.38 IC5.7
OP2BUF
  top 0.305: 56.52,43.48 55.05,42 R18.2 53,41 52,42 52,51.78 J5.8 | 56.52,43.48 56.86,43.81 57,43.88 57.02,43.98 59.41,46.37 IC7.3 | IC6.6 65.64,37.37 65,38.01 64.82,38.01 62,40.83 62,41 59,41 56.52,43.48
OPOUT1_H10  (via drill 0.3)
  top 0.305: R9.2 55.12,33 56.17,34.05 57.95,34.05 | IC1.6 64.35,28.36 61.18,31.54 60.47,31.54 57.95,34.05 | J5.3 65.25,53 64,54.25 55.12,54.25 54.5,53.62 54.5,50.38 53.38,49.25 v53.38,41.62 | 58,35.38 58,34.12 57.95,34.05 | 58,35.38 v58,37 | 58,35.38 54.75,35.38 53.5,34.12 53.5,33.75 49.75,30 49.25,30 49.12,30.12 v48,30.12 | v12.62,24.25 12.62,23.62 20.88,15.38 20.88,13.62 21.38,13.12 21.38,12.12 SV1.4
  route 0.305: v58,37 v53.38,41.62 | v12.62,24.25 12.88,24.25 15.12,22 33.75,22 40.25,28.5 45.5,28.5 47.12,30.12 v48,30.12
  gnd 0.305: v12.62,24.25 13.12,23.75 J2.H10
OPOUT2_H11  (via drill 0.3)
  top 0.305: 56.17,50.05 55.12,49 R6.2 55,48.88 v54,47.88 | 56.17,50.05 60.95,50.05 65,46 65.35,46 IC7.6 | J5.6 58.3,52.18 56.17,50.05 | v13.75,24.25 13.75,23.25 21.38,15.62 21.38,14.75 23,13.12 SV1.5 23.12,13.12 23.62,13.12 27.62,17.12 29,17.12 30.62,18.75 v30.62,22.62 | v45.62,41 v45.62,35.12
  route 0.305: v56.38,54.88 58.25,53 J5.6 | v30.62,22.62 30.62,24 37.25,30.62 41,30.62 45.5,35.12 v45.62,35.12 | v45.62,41 46.62,41 53.5,47.88 v54,47.88
  gnd 0.305: J2.H11 13.25,24.88 13.75,24.38 v13.75,24.25
PULSEINN1  (via drill 0.3)
  top 0.305: v80.12,30 80.12,28.93 R22.2 | v40.88,32.25 40,31.38 39.12,31.38 IC14.2 | v35,33.12 34.12,32.25 34.12,32 R44.1
  route 0.305: v80.12,30 79.12,31 60,31 54.5,36.5 46.12,36.5 41.88,32.25 v40.88,32.25 40.75,32.25 40.38,31.88 37.75,31.88 36.5,33.12 v35,33.12
PULSEINN2  (via drill 0.3)
  top 0.305: v96.12,28 R24.1 | v41.88,30.62 42.88,30.62 IC14.6 | v47,31.62 48.88,31.62 R47.2 v51.62,34.38
  route 0.305: v96.12,28 85,28 84.5,27.5 58.5,27.5 58.5,27.62 58.38,27.62 v51.62,34.38 | v41.88,30.62 46.12,30.62 46.12,30.75 v47,31.62
PULSEINN3  (via drill 0.3)
  top 0.305: v80.12,23.88 80.12,21.93 R28.2 | v42.38,29.12 42.38,28 39.75,25.38 39.12,25.38 IC15.2 39,25.38 38.25,25.38 34.12,29.5 R45.1
  route 0.305: v80.12,23.88 79,25 56,25 56,25.12 49.88,31.25 47.5,31.25 45.38,29.12 v42.38,29.12
PULSEINN4  (via drill 0.3)
  top 0.305: v95.88,22.12 94.95,21.2 R30.1 | IC15.6 43,24.62 v44,24.62 44,24.75 45.12,25.88 45.75,25.88 47.75,27.88 48.25,27.88 49.88,26.25 49.88,26 R46.2
  route 0.305: v95.88,22.12 95.88,22 53.88,22 51.25,24.62 v44,24.62
PULSEINP1  (via drill 0.3, 0.35)
  top 0.305: IC9.3 85.67,41.8 84.95,41.8 84.74,42 v84.08,42 | v34.88,46 37.5,43.38 39,43.38 IC12.2 | v43.75,61 v37.75,55 | v63.5,43.88 63.5,43.62 62.75,42.88 v62.75,42.12 | v73.88,41.62 73.88,41.25 75,40.12 75,39.5 R39.1
  route 0.305: 73.88,42 62.75,42 v62.75,42.12 | 73.88,42 v84.08,42 | v34.88,46 34.88,52.12 v37.75,55 | v43.75,61 57,61 64.5,53.5 64.5,49.12 63.5,48.12 v63.5,43.88 | 73.88,42 v73.88,41.62
PULSEINP2  (via drill 0.3, 0.35)
  top 0.305: v91.99,40.99 90.25,40.99 IC9.5 | v42.12,45.75 41.38,45 41.38,43.5 42.12,42.75 42.88,42.75 IC12.6 | v84,41 83.88,40.88 82.5,40.88 81.12,39.5 R37.2
  route 0.305: v91.99,40.99 v92,41 v84,41 60.88,41 60.12,41.75 60.12,42.62 53.25,49.5 45.5,49.5 45.12,49.12 45.12,49 42.12,46 v42.12,45.75
PULSEINP3  (via drill 0.3)
  top 0.305: v84.5,35.75 85.75,35.75 IC10.3 | v43,35.25 41.75,35.25 39.75,37.25 39.12,37.25 IC13.2 | v50.12,43.62 v50.12,42.38 | v75.12,36.25 75.12,35 R43.1
  route 0.305: 75.12,36 64.88,36 57.25,43.62 v50.12,43.62 | 75.12,36 83.12,36 83.38,35.75 v84.5,35.75 | v50.12,42.38 v43,35.25 | v75.12,36.25 75.12,36
PULSEINP4  (via drill 0.3)
  top 0.305: v90.25,34.25 90.25,35 IC10.5 | v41.25,36.62 42.88,36.62 IC13.6 | v79.88,35 R41.2
  route 0.305: 79.88,34 63,34 63,34.12 54.12,43 49.88,43 42.25,35.38 41.62,35.38 41.25,35.75 v41.25,36.62 | 79.88,34 84.12,34 | 84.12,34 90.25,34 v90.25,34.25 | 84.12,34 v84.12,35 | 79.88,34 v79.88,35
PULSEOUTN1  (via drill 0.3)
  top 0.305: IC3.1 85.03,30.98 84.56,31.44 | 84.56,31.44 84,32 R21.1 82.9,31.95 C34.2 | v100,40.88 100.88,41.75 100.88,42 R12.2 | v94,34.88 91.85,32.73 v91.85,32.58 | v84.5,31.25 84.5,31.38 84.56,31.44
  route 0.305: v94,34.88 v100,40.88 | v84.5,31.25 89,31.25 90.11,32.36 91.64,32.36 v91.85,32.58
PULSEOUTN2
  top 0.305: R23.2 91.38,30.32 IC3.7 | R38.2 100.88,36 100.12,35.25 100.12,35.12 98.12,33.12 94.12,33.12 93.12,32.12 R23.2 | R23.2 93.05,30.05 C36.1
PULSEOUTN3  (via drill 0.3)
  top 0.305: v97.25,27.38 102,32.12 102,36.88 101,37.88 101,39 R32.2 | v85.88,25.75 85.88,25 IC8.1 85.76,25 R27.1 82.9,24.95 C35.2
  route 0.305: v97.25,27.38 87.5,27.38 v85.88,25.75
PULSEOUTN4  (via drill 0.3)
  top 0.305: R29.2 92.38,24.32 IC8.7 | v94,46.12 93.12,45.25 93.12,45 R40.2 | v101,34.75 101,32 95.12,26.12 94.12,26.12 93.12,25.12 R29.2 | R29.2 93.05,23.05 C37.1
  route 0.305: v94,46.12 99.25,46.12 101,44.38 v101,34.75
PULSEOUTP1  (via drill 0.3)
  top 0.305: IC9.2 IC9.1 85.75,43.12 86,43.38 v86,44.75 | v93.25,37.75 93.12,37.88 93.12,39 R7.2
  route 0.305: v93.25,37.75 93.25,38.75 94.38,39.88 94.38,42.62 92.25,44.75 v86,44.75
PULSEOUTP2
  top 0.305: R33.2 90.54,42 90.52,41.98 | 90.52,41.98 IC9.6 | 90.52,41.98 90.25,42.25 IC9.7
PULSEOUTP3  (via drill 0.3)
  top 0.305: IC10.2 IC10.1 85.75,37.12 85.75,37.25 v86.38,37.88 | v100.12,43.75 100.88,44.5 100.88,45 R8.2 | v94.12,37.75 93.5,37.12 93,37.12 91.62,38.5 91.62,39.75 91.38,40 v90.25,40
  route 0.305: v94.12,37.75 v100.12,43.75 | v90.25,40 88.5,40 v86.38,37.88
PULSEOUTP4
  top 0.305: IC10.7 90.54,36 | 90.54,36 R36.2 | IC10.6 90.25,35.75 90.5,36 90.54,36
PULSESUMIN
  top 0.305: IC4.6 91.54,47.67 92.27,46.95 93.89,46.95 R1.1 | R1.1 R40.1 95,45 | 95,45 R8.1 R12.1 R32.1 R38.1 | R36.1 R7.1 R33.1 94.95,44.95 | 94.95,44.95 95,45 | C32.1 94.95,49.95 R1.1 | R1.1 94.95,44.95
PULSESUMOUT  (via drill 0.3)
  top 0.305: IC4.7 92.72,48.33 R1.2 93.1,48.05 C32.2 93.05,50.05 R34.1 93.12,52.12 93.88,52.88 93.88,55 89.75,59.12 v89.75,61.62
  route 0.305: J5.2 69.38,53 78,61.62 v89.75,61.62
SCLIN  (via drill 0.3)
  top 0.305: U1.8 102.75,5.38 v103.5,4.62 | v13.75,19.12 13.75,17.5 20.88,10.38 20.88,5 SV1.1 23.12,2.88 25.38,0.62 v61.5,0.62
  route 0.305: v103.5,4.62 99.5,0.62 v61.5,0.62
  gnd 0.305: J2.H7 13.25,19.75 13.75,19.25 v13.75,19.12
SDAIN  (via drill 0.3)
  top 0.305: U1.3 102.75,8.62 104.12,7.25 104.12,4.38 100.75,1 96.38,1 95.88,1.5 95.88,4.75 95.62,5 91.38,5 87.88,1.5 73.38,1.5 62.88,12 56,12 54.5,13.5 53.38,13.5 52.75,12.88 52.75,12.62 42,1.88 27,1.88 23.5,5.38 23.12,5.38 SV1.2 23,5.5 21.38,7.12 21.38,10.62 20.88,11.12 20.88,12.88 13.88,19.88 v13.88,20.38
  gnd 0.305: J2.H8 13.25,21.12 13.88,20.5 v13.88,20.38
TRANSIN
  top 0.305: R2.1 82.95,50.05 | 82.95,50.05 C33.1 82.9,48.05 R11.2 | IC4.2 85.91,48.45 86.63,48.45 86.81,48.62 86.81,49.33 86.08,50.05 82.95,50.05
TRANSOUT
  top 0.305: IC4.1 85.67,48.85 84.95,48.85 83.91,47.81 83.91,47.12 83.73,46.95 83,46.95 | 83,46.95 82.17,46.95 81.12,48 R11.1 81.12,48.12 81.12,49.88 C33.2 62,50 61,51 61,52.84 J5.5 | 83,46.95 83,45.05 R13.2 R20.2
VH  (via drill 0.3)
  top 0.305: C7.1 66.81,32 IC1.8 65.62,31 v64,32.62 v64,35.12 | v57.12,34.75 54.88,34.75 54,33.88 54,33.5 50,29.5 v48.88,29.5 | v65.62,43.62 65.62,42.88 | 65.62,42.88 65.62,40 IC6.8 | v64.5,48.25 64.75,48.25 65.38,48.88 65.62,48.88 IC7.8 | v69,35.38 69,39.62 65.75,42.88 65.62,42.88 | R_VH.2 43,7.88 42.12,8.75 42.12,21 v46.38,25.25
  route 0.305: v57.12,34.75 59,34.75 61.12,32.62 v64,32.62 | 65.62,47.12 v65.62,43.62 | v64.5,48.25 65.62,47.12 | 65.62,47.12 70,47.12 83.88,61 98,61 99.88,59.12 145,59.12 J1.3 | v64,35.12 66.12,35.12 66.38,35.38 v69,35.38 | v46.38,25.25 46.38,26.88 48.88,29.38 v48.88,29.5
VIN+
  top 0.508: C42.1 133.9,68.6 L1.1 135,67.5 C39.1 141.34,64.16 J1.5
VIN+CLEAN
  top 0.508: L1.2 127,67.5 C38.1 122.74,67.5 121.51,68.73 121.27,68.73 118,72 C43.1 106.67,72 105.67,73.01 104.53,73.01 104.45,72.92 68.92,72.92 IC11.1
VIN-
  top 0.508: J1.7 136.76,69.24 135,71 133,71 128,66 122,66 121,67 C40.1 118,67.5 L2.1 116.5,63.6 C44.2
VIN-CLEAN
  top 0.508: L2.2 107.9,69 C45.2 | C45.2 107,69.9 C41.1 | C45.2 104.89,67.99 98.01,67.99 94.34,71.66 92.66,71.66 U2.2
VL  (via drill 0.3)
  top 0.305: C8.1 67,35 | 67,35 66.81,35 | 66.81,35 IC6.5 | v63.38,34.62 63.38,30.38 64.75,29 66.62,29 66.88,28.75 66.88,28 66,27.12 65.75,27.12 IC1.5 65.62,27 v64.88,26.25 | v66.62,34.75 66.75,34.88 66.81,35 | v64.38,45.75 65,45.12 65.62,45.12 IC7.5 65.75,45.12 66,45.12 v67.38,46.5 | v64.38,40.38 v64.38,43.75 | 67,35 v67,37.75 | v61,25.62 61,24.38 60.62,24 60,24 54.5,18.5 53.75,18.5 44.25,9 R_VL.2
  route 0.305: v63.38,34.62 63.62,34.62 63.75,34.5 66.38,34.5 v66.62,34.75 | v64.38,43.75 v64.38,45.75 | v67,37.75 v64.38,40.38 | v61,25.62 64.25,25.62 v64.88,26.25 | J1.4 145,60.62 146.12,59.5 146.12,58.62 145.5,58 96,58 95.62,58.38 93.25,58.38 90.75,55.88 83.88,55.88 74.5,46.5 v67.38,46.5
VS+  (via drill 0.3)
  top 0.508: C16.1 90.9,49.66 | 90.9,49.66 IC4.8 | 90.74,43.51 90.9,43.66 C18.1 91,45.25 v91,46.25 | 90.74,43.51 IC9.8 | C20.1 90.9,37.66 90.68,37.44 | 90.68,37.44 IC10.8 | 90.9,31.66 C22.1 91,33.25 91,34.12 v91.5,34.62 | 90.9,31.66 IC3.8 | 90.9,25.66 C24.1 91,27.25 91,28.12 v91.5,28.62 | 90.9,25.66 IC8.8 | IC6.7 67.73,38.63 C28.1 67.88,38.5 67.88,38.25 v68.38,37.75 | IC7.7 66.08,48 67.12,48 | 67.12,48 C26.1 68.12,47.75 68.12,46 v73.75,40.38 | IC1.7 66.08,30 C30.1 68.25,29.88 v69,29.88 | IC11.3 72.1,69.9 C47.1 C1.1 67.5,67 64.24,67 63.24,68.01 59.33,68.01 59.33,68 59,68 58.1,67.1 C3.1 | 97,5.88 97,7 C6.1 97.12,7.12 100.62,10.62 102.75,10.62 104.12,9.25 108,9.25 U1.19 | 97,5.88 97,4 C9.1 | v91.25,25.62 91.12,25.62 90.9,25.66 | 97,5.88 92.75,5.88 87.88,10.75 IC5.8 | 90.68,37.44 v91.5,36.62 | 90.74,43.51 v91.62,42.62 | v91,49.75 90.9,49.66 | v90.88,31.75 90.9,31.66 | v58.5,28.75 47.5,28.75 47.5,28.5 45.88,26.88 45.12,26.88 v44,25.75 | 67.12,48 v67.12,49.38 | 31,54 28.12,54 26,56.12 J6.4 J6.3 J6.2 J6.1 | 31,54 C48.1 37,54.25 37,55.38 v43.75,62.12 | R_VH.3 40.5,4 40.5,7.75 41.38,8.62 41.38,13.12 40.5,14 R_O2.3 40.5,14.25 40.5,19 R_O1.3 | C54.1 v112.12,47 112.12,44.88 111.92,44.67 111.92,43.23 112.16,42.99 113.04,42.99 IC16.3 | IC2.3 32.02,50.98 31,52 31,54
  route 0.508: 67.12,65 67.5,65 C1.1 | 67.12,65 56.38,65 51.5,69.88 v43.75,62.12 | v91.25,25.62 94.25,25.62 97.62,22.25 97.62,20.62 IC5.8 | v91.5,34.62 v91.5,36.62 91.5,37.12 | 91.5,37.12 91.5,39.38 92.75,40.62 92.75,41.5 v91.62,42.62 | v91,46.25 v91,49.75 91,50 97.5,56.5 112.12,56.5 | v90.88,31.75 89.62,30.5 | 89.62,30.5 88.38,29.25 79.75,29.25 79.12,29.88 v69,29.88 68.75,29.88 67.62,28.75 v58.5,28.75 | 73.75,37.75 85.38,37.75 86,37.12 91.5,37.12 | 73.75,37.75 v68.38,37.75 | 73.75,37.75 v73.75,40.38 | 112.12,56.5 145,56.5 J1.2 | 89.62,30.5 v91.5,28.62 | v67.12,49.38 67.12,65 | 112.12,56.5 v112.12,47 | v44,25.75 40.5,22.25 40.5,19 R_O1.3
VS-  (via drill 0.3)
  top 0.508: C21.1 85.1,34 | 85.1,34 85.1,34.34 IC10.4 87.03,35.02 IC10.9 | C19.1 85.1,40.34 IC9.4 87.03,41.02 IC9.9 | C17.1 85.1,46.34 IC4.4 87.03,47.02 IC4.9 | 87.03,23.02 IC8.4 85.1,22.34 C25.1 85,20.75 85,8.62 80.25,3.88 80.25,3.25 IC5.4 | 87.03,23.02 IC8.9 IC3.9 | C29.1 60.1,35.91 IC6.4 61.5,36.09 | C27.1 60.1,43.88 | 60.1,43.88 60.1,44.91 IC7.4 | 91.5,65 C2.2 91.98,66 93.54,67.56 | 91.5,65 91.5,64.5 88,61 IC4.9 | IC4.9 IC9.9 | IC9.9 IC10.9 | IC10.9 IC3.9 | 91.5,65 91.27,64.77 60.71,64.77 60.47,65.01 59.33,65.01 58.33,64 C10.1 58.25,64.25 v55.88,66.62 | 61.5,36.09 64.05,36.09 66.65,33.49 72.5,33.49 | 85.1,34 84.59,33.49 72.5,33.49 | 72.5,26.84 70.63,26.84 70.47,27.01 67.53,27.01 65.53,25 65,25 62.91,27.09 IC1.4 60.1,26.91 C31.1 59.88,25.25 53.12,25.25 46.88,19 R_O1.1 | 72.5,26.84 84.94,26.84 C23.1 | C15.1 96.88,9 96.88,13.12 87.12,22.88 87.03,23.02 | IC3.9 87,29 85.88,29 IC3.4 | 72.5,26.84 72.5,33.49 | U2.3 93.54,67.56 | 93.54,67.56 C46.2 | J7.4 J7.3 J7.2 J7.1 23.25,63.88 23.75,63.88 28,68.12 49.5,68.12 v51.88,70.5 | v58,43.88 60.1,43.88 | v55.12,43 v56.38,44.25 | 61.5,36.09 v61.5,36.62
  route 0.508: R_VL.3 40.5,9 45.5,14 R_O2.1 45.5,14.25 45.5,19 R_O1.1 | v55.88,66.62 55.88,66.75 52.12,70.5 v51.88,70.5 | v58,43.88 57.62,44.25 v56.38,44.25 | v61.5,36.62 v55.12,43

## Text on the board
tPlace: GND | LDAC ADDR CLR 1V8 DACP1 P2 DACN1 N2 | L7905 | VIN- | 8.5mm diam. | GND | VS- | VS+ | 1.8V | 3.3V | 12V | GND | VIN+ | Vlow | Vhigh | +VS 5 | OP2BUF | OFFSETIN2 | OPOUT2 H11 | TRANSOUT | OFFSETIN1 | OPOUT1 H10 | PULSESUMOUT | OPIN | AR 5V | H26_FMCOUT3 | H25_FMCOUT2 | GND | DAC8 7 6 5 4 3 OFFSET2 1 | GND | GND | GND | H23_FMCOUT1 | H22_FMCOUT0 | C15_pulse4p | C14_pulse3p | GND | GND | H20_FMCIN7 | C11_pulse2p | H19_FMCIN6 | C10_pulse1p | GND | GND | H17_FMCIN5 | H38_pulse4n | H16_FMCIN4 | H37_pulse3n | GND | GND | H14_FMCIN3 | H35_pulse2n | H13_FMCIN2 | H34_pulse1n | Offset1 | GND | GND | H11_FMCIN1 | H32_FMCOUT7 | H10_FMCIN0 | Offset2 | H31_FMCOUT6 | GND | GND | VL | H8_SDAIN | H29_FMCOUT5 | H7_SCLIN | C10GX FMC breakout, v1.43 / by Andre Dubovskiy and Dr. Andy Haas / NYU, 2023 | H28_FMCOUT4 | VH